# EAGLE schematic amplifier_only_clean (EAGLE 9.2.0)
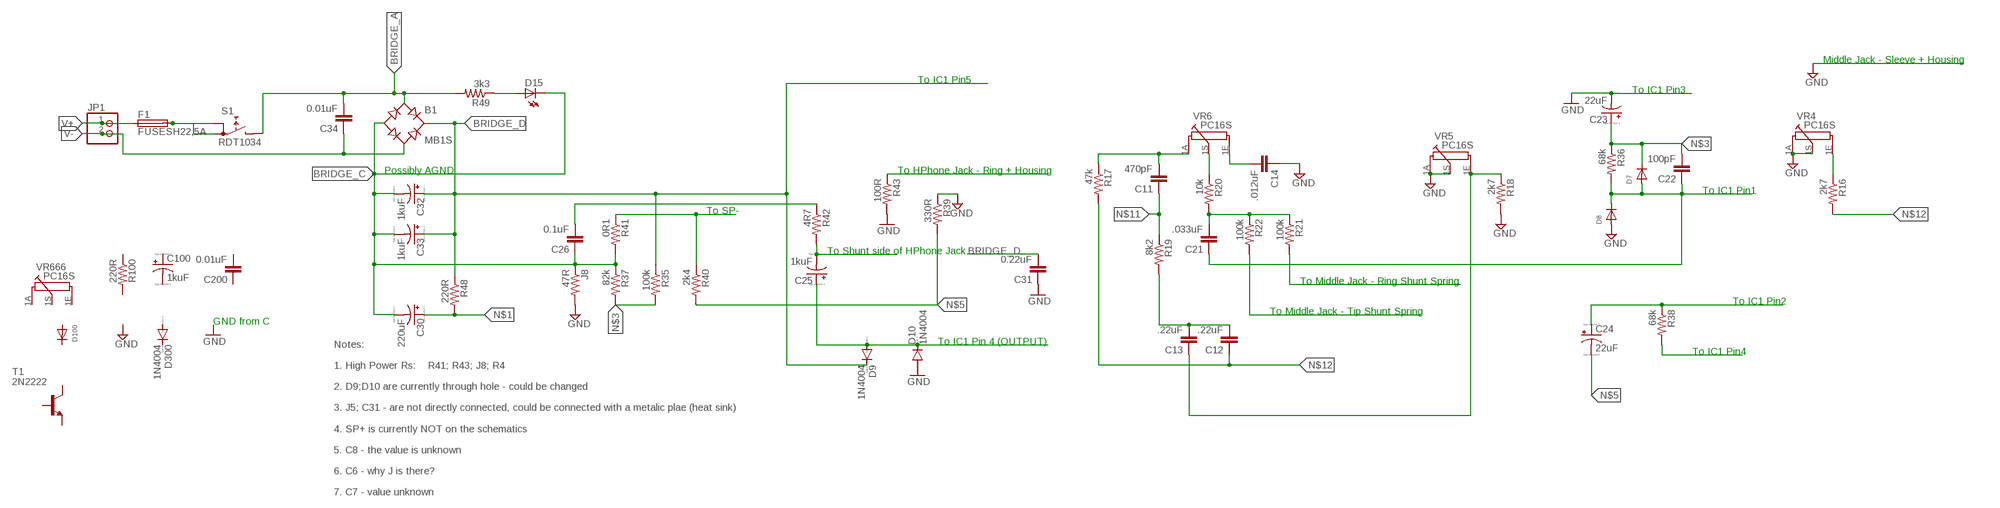
[diagram p0: schematic, sheet 1, part 1 of 2]
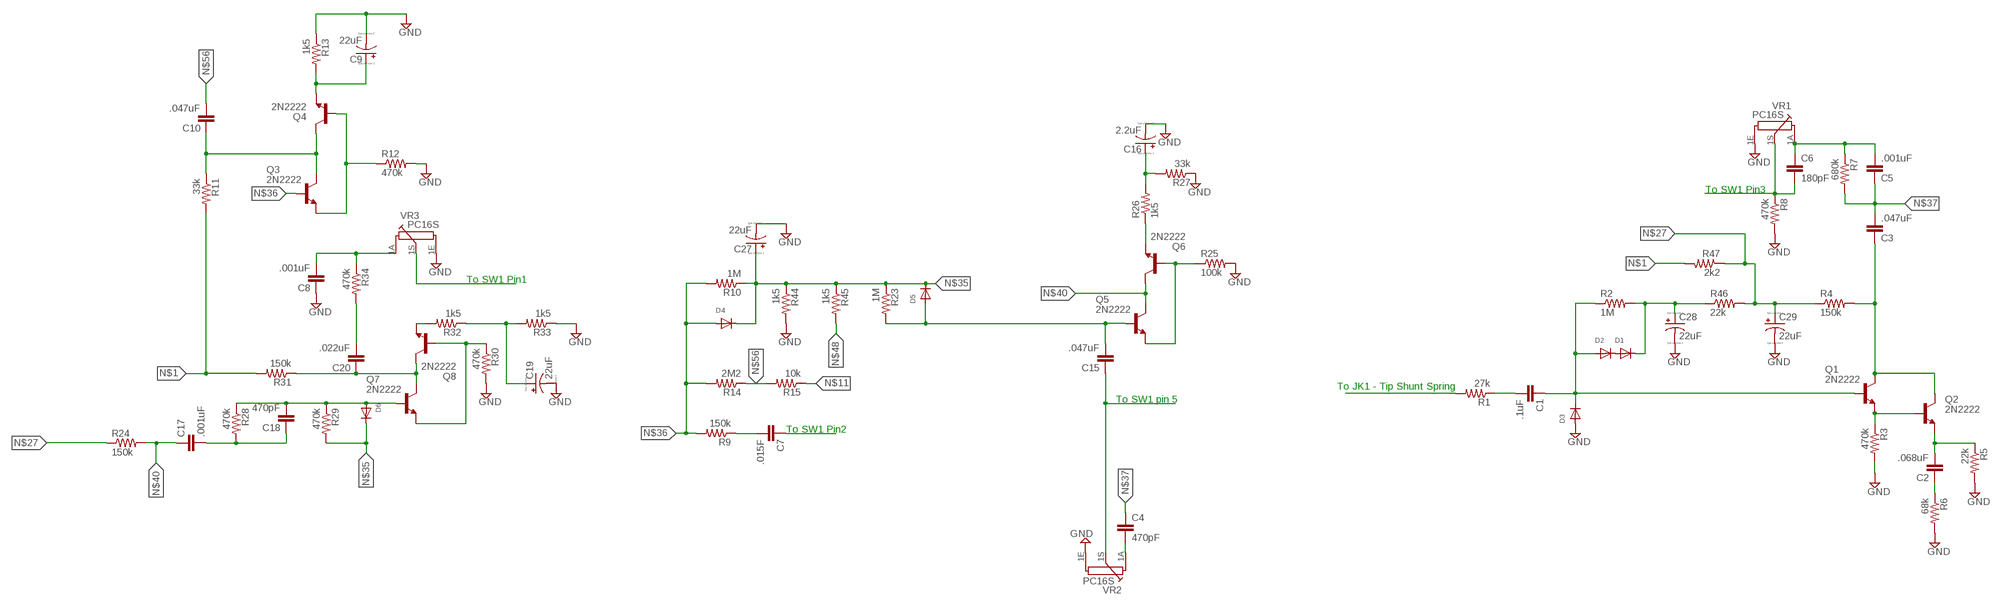
[diagram p1: schematic, sheet 1, part 2 of 2]

## Parts
B1  MB1S  [SOIC-4]
C1  .1uF  C-EUC0603  [C0603]
C2  .068uF  C-EUC0603  [C0603]
C3  .047uF  C-EUC0603  [C0603]
C4  470pF  C-EUC0603  [C0603]
C5  .001uF  C-EUC0603  [C0603]
C6  180pF  C-EUC0603  [C0603]
C7  .015F  C-EUC0603  [C0603]
C8  .001uF  C-EUC0603  [C0603]
C9  22uF  CPOL-USE10-30  [EB30D]
C10  .047uF  C-EUC0603  [C0603]
C11  470pF  C-EUC0603  [C0603]
C12  .22uF  C-EUC0603  [C0603]
C13  .22uF  C-EUC0603  [C0603]
C14  .012uF  C-EUC0603  [C0603]
C15  .047uF  C-EUC0603  [C0603]
C16  2.2uF  CPOL-USE10-30  [EB30D]
C17  .001uF  C-EUC0603  [C0603]
C18  470pF  C-EUC0603  [C0603]
C19  22uF  CPOL-USE10-30  [EB30D]
C20  .022uF  C-EUC0603  [C0603]
C21  .033uF  C-EUC0603  [C0603]
C22  100pF  C-EUC0603  [C0603]
C23  22uF  CPOL-USE10-30  [EB30D]
C24  22uF  CPOL-USE10-30  [EB30D]
C25  1kuF  CPOL-USE10-30  [EB30D]
C26  0.1uF  C-EUC0603  [C0603]
C27  22uF  CPOL-USE10-30  [EB30D]
C28  22uF  CPOL-USE10-30  [EB30D]
C29  22uF  CPOL-USE10-30  [EB30D]
C30  220uF  CPOL-USE3.5-8  [E3,5-8]
C31  0.22uF  C-EUC0603  [C0603]
C32  1kuF  CPOL-USE10-30  [EB30D]
C33  1kuF  CPOL-USE10-30  [EB30D]
C34  0.01uF  C-EUC0603  [C0603]
C100  1kuF  CPOL-USE10-30  [EB30D]
C200  0.01uF  C-EUC0603  [C0603]
D1  DIODESOD-323F  [SOD-323F]
D2  DIODESOD-323F  [SOD-323F]
D3  DIODESOD-323F  [SOD-323F]
D4  DIODESOD-323F  [SOD-323F]
D5  DIODESOD-323F  [SOD-323F]
D6  DIODESOD-323F  [SOD-323F]
D7  DIODESOD-323F  [SOD-323F]
D8  DIODESOD-323F  [SOD-323F]
D9  1N4004  [DO41-10]
D10  1N4004  [DO41-10]
D15  LEDCHIP-LED0603  [CHIP-LED0603]
D100  DIODESOD-323F  [SOD-323F]
D300  1N4004  [DO41-10]
F1  FUSESH22,5A  [SH22,5A]
J8  47R  R-US_R0603  [R0603]
JP1  PINHD-1X2  [1X02]
Q1  2N2222  [TO92-EBC-OVAL]
Q2  2N2222  [TO92-EBC-OVAL]
Q3  2N2222  [TO92-EBC-OVAL]
Q4  2N2222  [TO92-EBC-OVAL]
Q5  2N2222  [TO92-EBC-OVAL]
Q6  2N2222  [TO92-EBC-OVAL]
Q7  2N2222  [TO92-EBC-OVAL]
Q8  2N2222  [TO92-EBC-OVAL]
R1  27k  R-US_R0603  [R0603]
R2  1M  R-US_R0603  [R0603]
R3  470k  R-US_R0603  [R0603]
R4  150k  R-US_R0603  [R0603]
R5  22k  R-US_R0603  [R0603]
R6  68k  R-US_R0603  [R0603]
R7  680k  R-US_R0603  [R0603]
R8  470k  R-US_R0603  [R0603]
R9  150k  R-US_R0603  [R0603]
R10  1M  R-US_R0603  [R0603]
R11  33k  R-US_R0603  [R0603]
R12  470k  R-US_R0603  [R0603]
R13  1k5  R-US_R0603  [R0603]
R14  2M2  R-US_R0603  [R0603]
R15  10k  R-US_R0603  [R0603]
R16  2k7  R-US_R0603  [R0603]
R17  47k  R-US_R0603  [R0603]
R18  2k7  R-US_R0603  [R0603]
R19  8k2  R-US_R0603  [R0603]
R20  10k  R-US_R0603  [R0603]
R21  100k  R-US_R0603  [R0603]
R22  100k  R-US_R0603  [R0603]
R23  1M  R-US_R0603  [R0603]
R24  150k  R-US_R0603  [R0603]
R25  100k  R-US_R0603  [R0603]
R26  1k5  R-US_R0603  [R0603]
R27  33k  R-US_R0603  [R0603]
R28  470k  R-US_R0603  [R0603]
R29  470k  R-US_R0603  [R0603]
R30  470k  R-US_R0603  [R0603]
R31  150k  R-US_R0603  [R0603]
R32  1k5  R-US_R0603  [R0603]
R33  1k5  R-US_R0603  [R0603]
R34  470k  R-US_R0603  [R0603]
R35  100k  R-US_R0603  [R0603]
R36  68k  R-US_R0603  [R0603]
R37  82k  R-US_R0603  [R0603]
R38  68k  R-US_R0603  [R0603]
R39  330R  R-US_R0603  [R0603]
R40  2k4  R-US_R0603  [R0603]
R41  0R1  R-US_R0603  [R0603]
R42  4R7  R-US_R0603  [R0603]
R43  100R  R-US_R0603  [R0603]
R44  1k5  R-US_R0603  [R0603]
R45  1k5  R-US_R0603  [R0603]
R46  22k  R-US_R0603  [R0603]
R47  2k2  R-US_R0603  [R0603]
R48  220R  R-US_R0603  [R0603]
R49  3k3  R-US_R0603  [R0603]
R100  220R  R-US_R0603  [R0603]
S1  RDT1034  [RDT1034]
T1  2N2222  [TO92-EBC-OVAL]
VR1  PC16S  [PC16S]
VR2  PC16S  [PC16S]
VR3  PC16S  [PC16S]
VR4  PC16S  [PC16S]
VR5  PC16S  [PC16S]
VR6  PC16S  [PC16S]
VR666  PC16S  [PC16S]

## Nets
BRIDGE_A: B1.~1(AC1) C34.2 R49.2 S1.B
BRIDGE_C: B1.- C26.1 C30.- C32.- C33.- D15.C J8.1 R37.1 R41.2
BRIDGE_D: B1.+ C31.2 C32.+ C33.+ D9.C R35.1 R48.1
BRIDGEA: F1.2 S1.A S1.A1
GND: C8.1 C9.- C14.1 C16.- C19.- C23.- C27.- C28.- C29.- C31.1 D3.A D8.A D10.A J8.2 R3.2 R5.2 R6.2 R8.2 R12.2 R13.1 R18.2 R25.2 R27.1 R30.2 R33.1 R39.1 R43.2 R44.2 VR1.1E VR2.1E VR3.1E VR4.1A VR4.1S VR5.1A VR5.1S
N$1: C30.+ R11.2 R31.2 R47.2 R48.2
N$2: D15.A R49.1
N$3: C22.2 C23.+ D7.C R35.2 R36.1 R37.2
N$4: R40.1 R41.1
N$5: C24.- R39.2 R40.2
N$6: C26.2 R42.1
N$7: C25.- R42.2
N$8: C25.+ D9.A D10.C
N$9: R43.1
N$10: C11.2 R17.1 VR6.1A
N$11: C11.1 R15.1 R19.1
N$12: C12.1 R16.2 R17.2
N$13: C12.2 C13.2 R19.2
N$14: C13.1 R18.1 VR5.1E
N$15: R20.1 VR6.1S
N$16: C21.2 R20.2 R21.1 R22.1
N$17: C21.1 C22.1 D7.A D8.C R36.2
N$18: R22.2
N$19: R21.2
N$20: R16.1 VR4.1E
N$21: C24.+ R38.1
N$22: R38.2
N$23: C8.2 R34.1 VR3.1A
N$24: C20.2 R34.2
N$25: VR3.1S
N$26: Q8.E R32.2
N$27: C29.+ R4.1 R24.1 R46.2 R47.1
N$28: Q7.E Q8.B R30.1
N$29: C18.2 D6.A Q7.B R28.1 R29.1
N$30: Q5.E Q6.B R25.1
N$31: C20.1 Q7.C Q8.C R31.1
N$32: C10.1 Q3.C Q4.C R11.1
N$33: Q3.E Q4.B R12.1
N$34: C9.+ Q4.E R13.2
N$35: C27.+ D4.C D5.C D6.C R10.1 R23.1 R29.2 R44.1 R45.1
N$36: D4.A Q3.B R9.2 R10.2 R14.2
N$37: C3.2 C4.1 C5.1 R7.2
N$38: C15.2 D5.A Q5.B R23.2
N$39: C17.2 C18.1 R28.2
N$40: C17.1 Q5.C Q6.C R24.2
N$41: C15.1 VR2.1S
N$42: C4.2 VR2.1A
N$43: C6.1 R8.1 VR1.1S
N$44: C3.1 Q1.C Q2.C R4.2
N$45: C1.2 R1.1
N$46: C1.1 D2.A D3.C Q1.B R2.1
N$47: R1.2
N$48: R45.2
N$49: D1.A D2.C
N$50: C2.2 Q2.E R5.1
N$51: C2.1 R6.1
N$52: C5.2 C6.2 R7.1 VR1.1A
N$53: C28.+ D1.C R2.2 R46.1
N$54: Q6.E R26.1
N$55: C16.+ R26.2 R27.2
N$56: C10.2 R14.1 R15.2
N$57: C7.2 R9.1
N$58: C7.1
N$59: C19.+ R32.1 R33.2
N$60: C14.2 VR6.1E
N$62: Q1.E Q2.B R3.1
V+: F1.1 JP1.1
V-: B1.~2(AC2) C34.1 JP1.2
Unconnected: C100.+ C100.- C200.1 C200.2 D100.A D100.C D300.A D300.C R100.1 R100.2 T1.B T1.C T1.E VR666.1A VR666.1E VR666.1S

## Notes on the sheet
- Middle Jack - Sleeve + Housing
- To IC1 Pin5
- To IC1 Pin3 | To SW1 Pin3
- Possibly AGND | To HPhone Jack - Ring + Housing
- To SW1 Pin1
- To IC1 Pin1
- To SP-
- To Shunt side of HPhone Jack
- To Middle Jack - Ring Shunt Spring | To JK1 - Tip Shunt Spring
- To IC1 Pin2 | To SW1 pin 5
- To Middle Jack - Tip Shunt Spring
- GND from C
- To SW1 Pin2
- To IC1 Pin 4 (OUTPUT)
- To IC1 Pin4
- Notes:
  
  1. High Power Rs:    R41; R43; J8; R4
  
  2. D9;D10 are currently through hole - could be changed
  
  3. J5; C31 - are not directly connected, could be connected with a metalic plae (heat sink)
  
  4. SP+ is currently NOT on the schematics
  
  5. C8 - the value is unknown
  
  6. C6 - why J is there?
  
  7. C7 - value unknown

## Library data of the parts
B1 = rectifier:MB*S: Bridge Rectifier Source: http://www.fairchildsemi.com/ds/MB/MB6S.pdf
C1-C8 C10-C15 C17 C18 C20-C22 C26 C31 C34 C200 = rcl:C-EU: CAPACITOR, European symbol; SPICEPREFIX: C
C9 C16 C19 C23-C25 C27-C30 C32 C33 C100 = resistor:CPOL-US: POLARIZED CAPACITOR, American symbol
D1-D8 D100 = adafruit:DIODE: Diode SMADIODE - SMA Surface Mount Package 20V 1A Schottky Diode Digikey: 641-1014-6-ND DO-1N4148 - Through Hole Small Current Diode SOD-123 20V 1 A (.5mV Vf) Schottky Diode - Digikey: MBRX120TPMSCT-ND SOD-323 10V 570mA (.38mV Vf, 3ns) Schottky Diode - Digikey: ZLLS410CT-ND SOD-523 30V 30mA Schottky Diode (RB751S-40TE61) - Digikey: RB751S-40TE61CT-ND SOT23-R/W - SOT23 Package (R = Solder Paste/Reflow Ovens, W = Hand-Soldering) BAT54Film 40V 300mA - Digikey: 497-7162-1-ND
D9 D10 D300 = diode:1N4004: DIODE general purpose rectifier, 1 A
D15 = led:LED: LED OSRAM: - CHIPLED LG R971, LG N971, LY N971, LG Q971, LY Q971, LO R971, LY R971 LH N974, LH R974 LS Q976, LO Q976, LY Q976 LO Q996 - Hyper CHIPLED LW Q18S LB Q993, LB Q99A, LB R99A - SideLED LS A670, LO A670, LY A670, LG A670, LP A670 LB A673, LV A673, LT A673, LW A673 LH A674 LY A675 LS A676, LA A676, LO A676, LY A676, LW A676 LS A679, LY A679, LG A679 - Hyper Micro SIDELED® LS Y876, LA Y876, LO Y876, LY Y876 LT Y87S - SmartLED LW L88C, LW L88S LB L89C, LB L89S, LG L890 LS L89K, LO L89K, LY L89K LS L896, LA L896, LO L896, LY L896 - TOPLED LS T670, LO T670, LY T670, LG T670, LP T670 LSG T670, LSP T670, LSY T670, LOP T670, LYG T670 LG T671, LOG T671, LSG T671 LB T673, LV T673, LT T673, LW T673 LH T674 LS T676, LA T676, LO T676, LY T676, LB T676, LH T676, LSB T676, LW T676 LB T67C, LV T67C, LT T67C, LS T67K, LO T67K, LY T67K, LW E67C LS E67B, LA E67B, LO E67B, LY E67B, LB E67C, LV E67C, LT E67C LW T67C LS T679, LY T679, LG T679 LS T770, LO T770, LY T770, LG T770, LP T770 LB T773, LV T773, LT T773, LW T773 LH T774 LS E675, LA E675, LY E675, LS T675 LS T776, LA T776, LO T776, LY T776, LB T776 LHGB T686 LT T68C, LB T68C - Hyper Mini TOPLED® LB M676 - Mini TOPLED Santana® LG M470 LS M47K, LO M47K, LY M47K Source: http://www.osram.convergy.de LUXEON: - LUMILED® LXK2-PW12-R00, LXK2-PW12-S00, LXK2-PW14-U00, LXK2-PW14-V00 LXK2-PM12-R00, LXK2-PM12-S00, LXK2-PM14-U00 LXK2-PE12-Q00, LXK2-PE12-R00, LXK2-PE12-S00, LXK2-PE14-T00, LXK2-PE14-U00 LXK2-PB12-K00, LXK2-PB12-L00, LXK2-PB12-M00, LXK2-PB14-N00, LXK2-PB14-P00, LXK2-PB14-Q00 LXK2-PR12-L00, LXK2-PR12-M00, LXK2-PR14-Q00, LXK2-PR14-R00 LXK2-PD12-Q00, LXK2-PD12-R00, LXK2-PD12-S00 LXK2-PH12-R00, LXK2-PH12-S00 LXK2-PL12-P00, LXK2-PL12-Q00, LXK2-PL12-R00 Source: www.luxeon.com KINGBRIGHT: KA-3528ASYC Source: www.kingbright.com
F1 = fuse:FUSE: Fuse; OC_FARNELL: unknown; OC_NEWARK: unknown
J8 R1-R49 R100 = rcl:R-US_: RESISTOR, American symbol; SPICEPREFIX: R
JP1 = pinhead:PINHD-1X2: PIN HEADER
Q1-Q8 T1 = adafruit:2N2222: NPN TRANSISTOR Big oval pads
S1 = switch:RDT1034: PUSH SWITCH www.radiohm.com
VR1-VR6 VR666 = piher:PC16S: POTENTIOMETER single carbon potentiometer, 16 mm, S3ROH; OC_FARNELL: 4452940; OC_NEWARK: unknown